# Altium schematic sheet Block.SchDoc: Title
size A3; Date: Date; CompanyName: Integrated Micro-Electronics Bulgaria; Organization: Design & Development Department; Address1: Drawing Type; Address2: Address 1; Address3: Address 2; Address4: Address 3; DocumentNumber: 730xxx; Revision: 01; SheetNumber: 1; SheetTotal: 1; PageSetup: Record=PageOptions|CenterHorizontal=True|CenterVertical=True|PrintScale=0.70|XCorrection=1.00|YCorrection=1.00|PrintKind=2|BorderSize=5000000|LeftOffset=0|BottomOffset=0|Orientation=2|PaperLength=1000|PaperWidth=1000|Scale=100|PaperSource=7|PrintQuality=-4|MediaType=1|DitherType=10|PaperKind=A4|PrintScaleMode=1; SheetSize: A3; Time: Time; ModifiedDate: Mod. Date
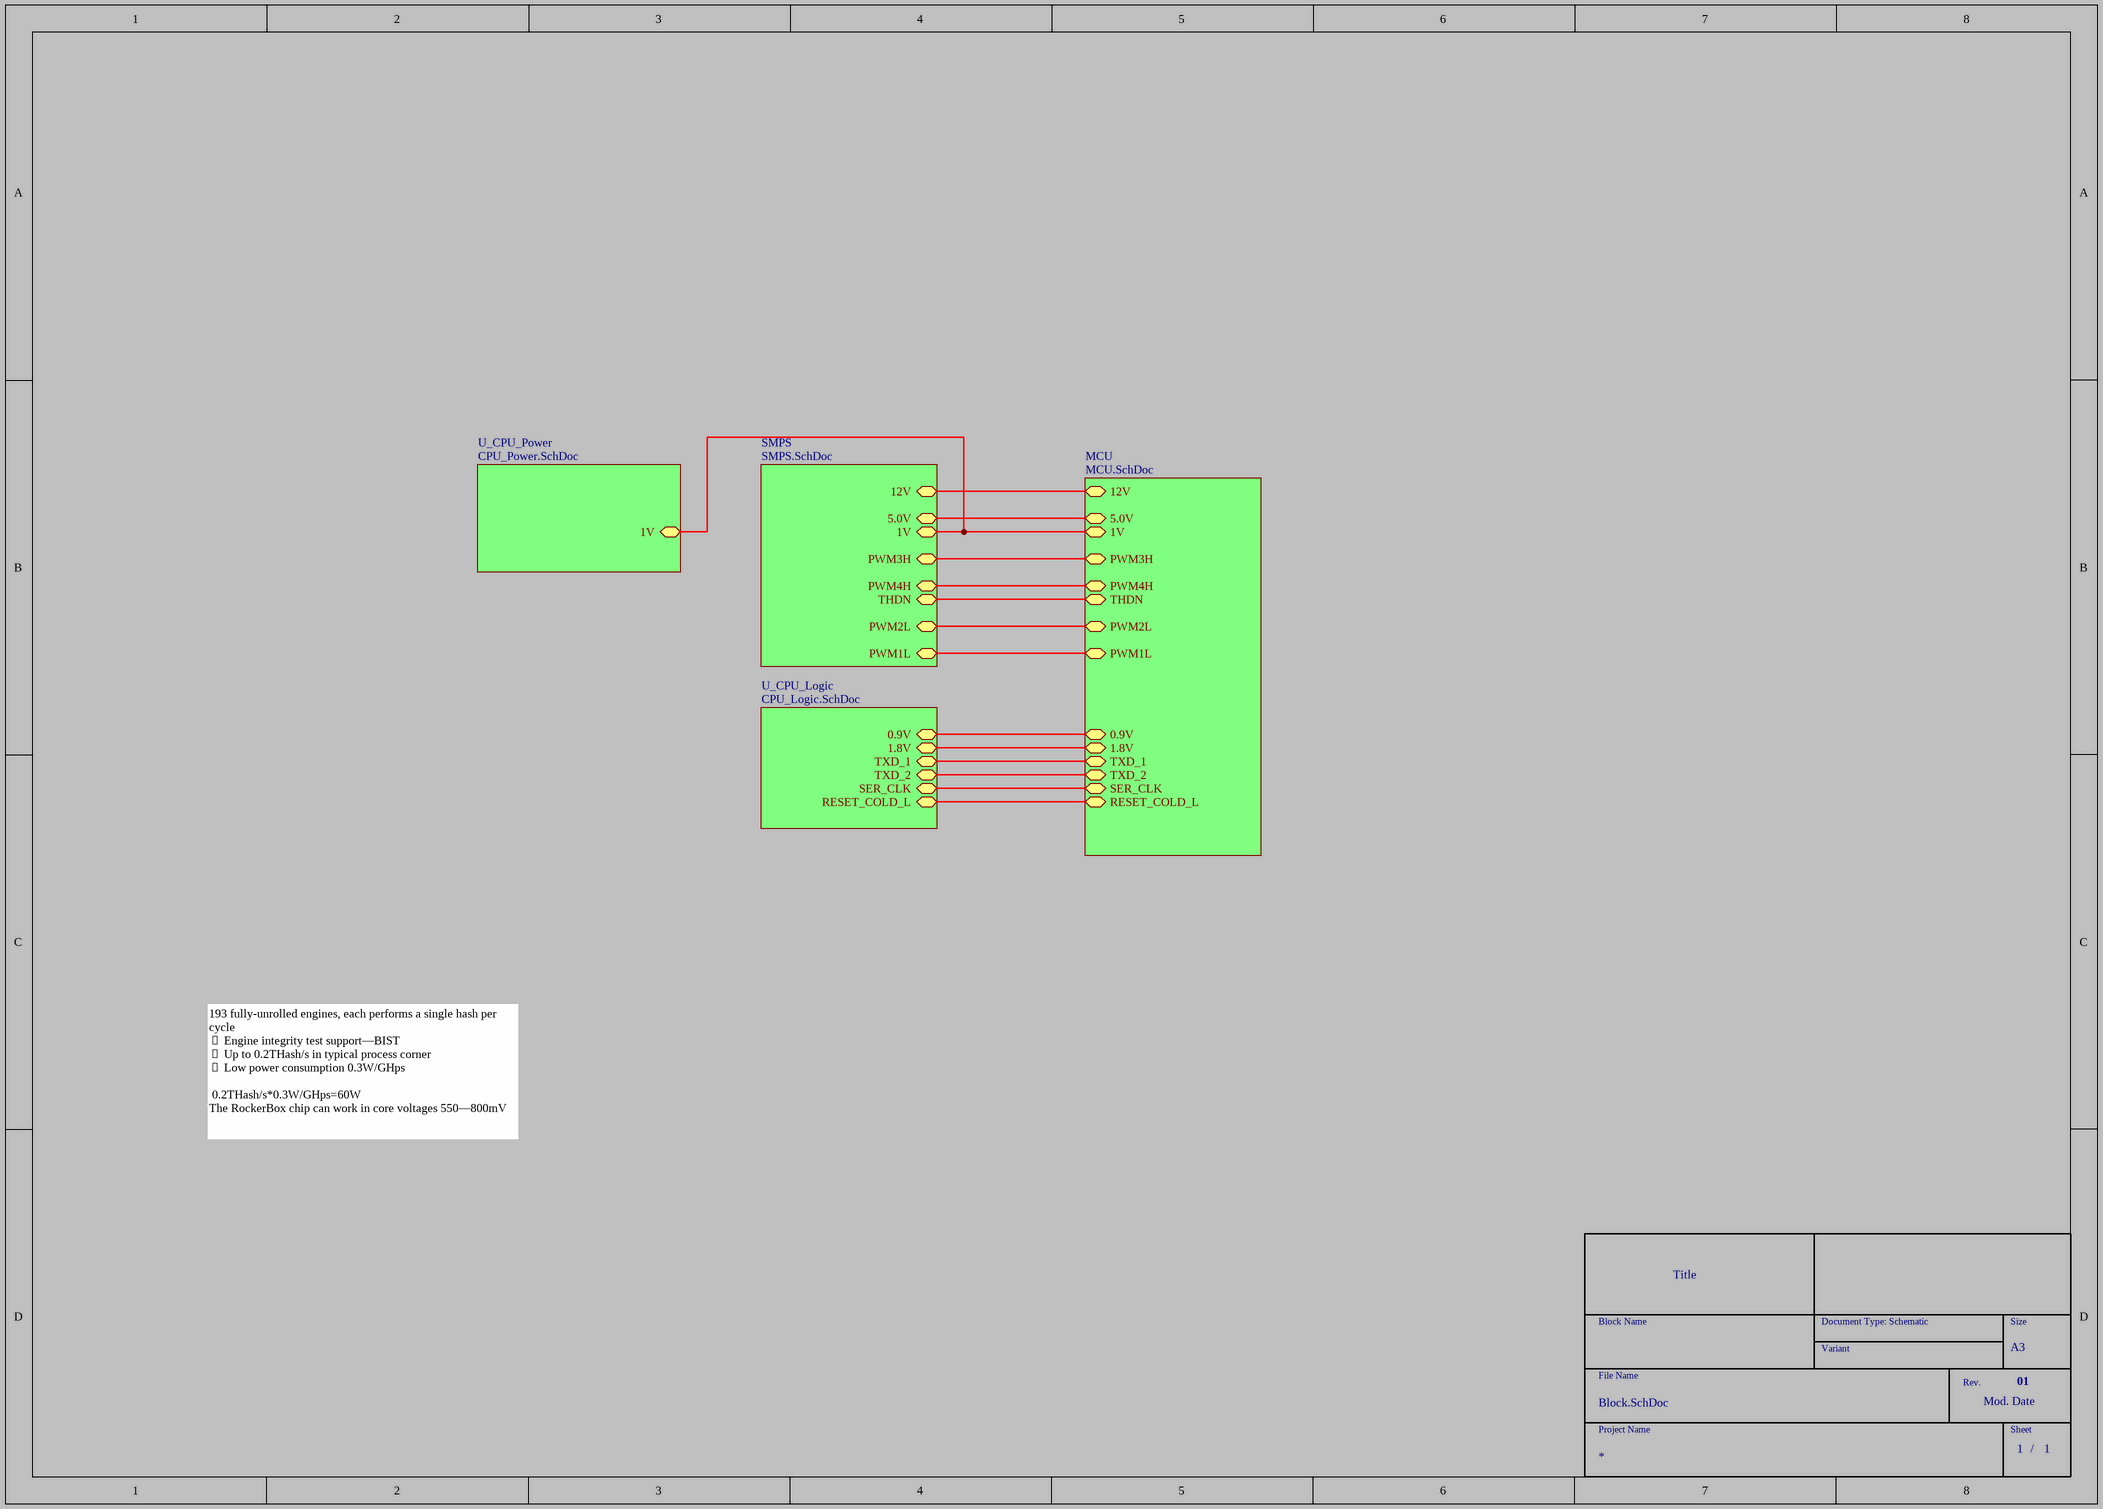
[diagram p0: Block.SchDoc]

## Sub-sheets
MCU = MCU.SchDoc: 1V, 12V, 5.0V, TXD_1, PWM3H, PWM4H, PWM2L, PWM1L, RESET_COLD_L, 1.8V, SER_CLK, 0.9V, TXD_2, THDN
SMPS = SMPS.SchDoc: 1V, 12V, 5.0V, PWM3H, PWM4H, PWM2L, PWM1L, THDN
U_CPU_Logic = CPU_Logic.SchDoc: 1.8V, TXD_1, SER_CLK, RESET_COLD_L, 0.9V, TXD_2
U_CPU_Power = CPU_Power.SchDoc: 1V

## Nets
(unnamed): sheet U_CPU_Logic/1.8V, sheet MCU/1.8V
(unnamed): sheet U_CPU_Logic/TXD_1, sheet MCU/TXD_1
(unnamed): sheet U_CPU_Logic/SER_CLK, sheet MCU/SER_CLK
(unnamed): sheet U_CPU_Logic/RESET_COLD_L, sheet MCU/RESET_COLD_L
(unnamed): sheet U_CPU_Logic/0.9V, sheet MCU/0.9V
(unnamed): sheet U_CPU_Logic/TXD_2, sheet MCU/TXD_2
(unnamed): sheet U_CPU_Power/1V, sheet MCU/1V, sheet SMPS/1V
(unnamed): sheet MCU/12V, sheet SMPS/12V
(unnamed): sheet MCU/5.0V, sheet SMPS/5.0V
(unnamed): sheet MCU/PWM3H, sheet SMPS/PWM3H
(unnamed): sheet MCU/PWM4H, sheet SMPS/PWM4H
(unnamed): sheet MCU/PWM2L, sheet SMPS/PWM2L
(unnamed): sheet MCU/PWM1L, sheet SMPS/PWM1L
(unnamed): sheet MCU/THDN, sheet SMPS/THDN

## Notes on the sheet
- 193 fully-unrolled engines, each performs a single hash per cycle
   Engine integrity test support—BIST
   Up to 0.2THash/s in typical process corner
   Low power consumption 0.3W/GHps
  0.2THash/s*0.3W/GHps=60W
  The RockerBox chip can work in core voltages 550—800mV
- Block Name
- Document Type: Schematic
- Size
- File Name
- Variant
- Rev.
- Project Name
- Sheet
- /